# EAGLE design iGeigie-v2 (EAGLE 5.10)
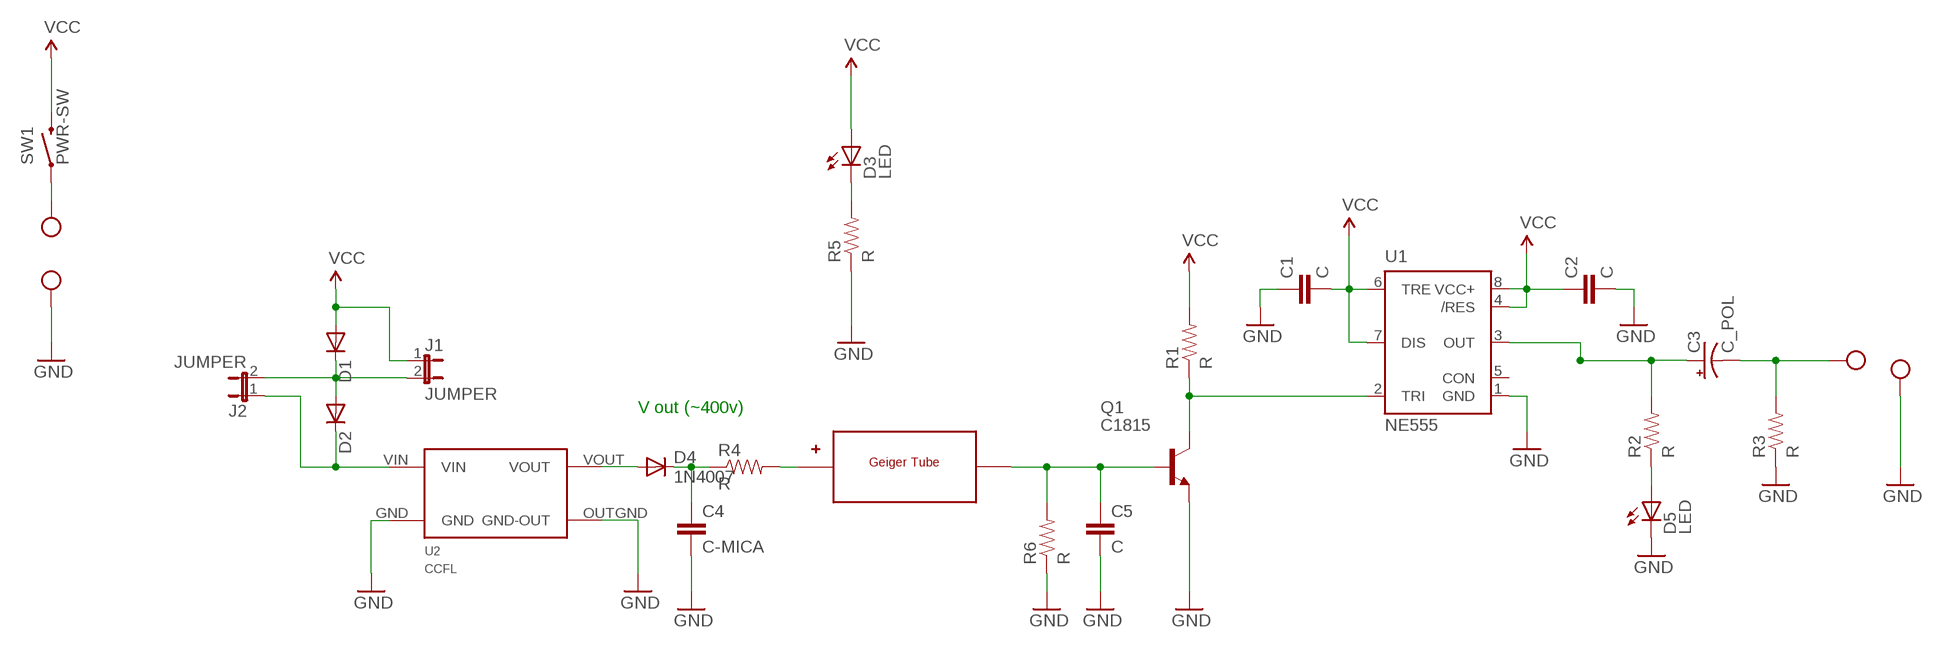
[diagram p0: schematic, sheet 1]

## Parts
C1  C  [C050-025X075]
C2  C  [C050-025X075]
C3  C_POL  [CPOL-RADIAL-100UF-25V]
C4  C-MICA  [C075-063X106]
C5  C  [C050-025X075]
D1  1N4004  [DO41-10]
D2  1N4004  [DO41-10]
D3  LED  [LED3MM]
D4  1N4007  1N4004  [DO41-10]
D5  LED  [LED3MM]
J1  JUMPER  [1X02]
J2  JUMPER  [1X02]
Q1  C1815  [TO92]
R1  R  [AXIAL-0.3]
R2  R  [AXIAL-0.3]
R3  R  [AXIAL-0.3]
R4  R  [AXIAL-0.3]
R5  R  [AXIAL-0.3]
R6  R  [AXIAL-0.3]
SW1  PWR-SW  [PWR_SWITCH]
U1  NE555  [DIL-08]
U2  CCFL  [CCFL]
U$1  PIN  [PIN]
U$2  PIN  [PIN]
U$3  PIN  [PIN]
U$4  PIN  [PIN]
U$5  GEIGER  [GEIGER]

## Nets
GND: C1.1 C2.2 C4.2 C5.2 D5.K(C) Q1.3(E) R3.P$1 R5.P$1 R6.P$1 U1.1(GND) U2.GND U2.OUTGND(GND-OUT) U$2.P$1 U$3.P$1
N$1: C4.1 D4.C R4.P$1
N$2: R4.P$2 U$5.+
N$3: D3.K(C) R5.P$2
N$4: D1.C D2.A J1.2 J2.2
N$5: C5.1 Q1.2(B) R6.P$2 U$5.-
N$6: Q1.1(C) R1.P$1 U1.2(TRI)
N$7: C3.+ R2.P$2 U1.3(OUT)
N$8: D5.A R2.P$1
N$9: C3.- R3.P$2 U$1.P$1
N$10: D2.C J2.1 U2.VIN
N$11: D4.A U2.VOUT
N$12: SW1.2 U$4.P$1
VCC: C1.2 C2.1 D1.A D3.A J1.1 R1.P$2 SW1.3 U1.4(/RES) U1.6(TRE) U1.7(DIS) U1.8(VCC+)
Unconnected: U1.5(CON)

## Notes on the sheet
- V out (~400v)

## Library data of the parts
C1 C2 C5 = iGeigie:C
C3 = iGeigie:C_POL
C4 = iGeigie:C-MICA
D1 D2 D4 = iGeigie:1N4004: DIODE general purpose rectifier, 1 A
D3 D5 = iGeigie:LED
J1 J2 = iGeigie:JUMPER
Q1 = iGeigie:C1815: NPN Transistor
R1-R6 = iGeigie:R
SW1 = iGeigie:PWR-SW
U1 = iGeigie:NE555: General purpose bipolar Timer
U2 = iGeigie:CCFL
U$1-U$4 = iGeigie:PIN
U$5 = iGeigie:GEIGER

## Board
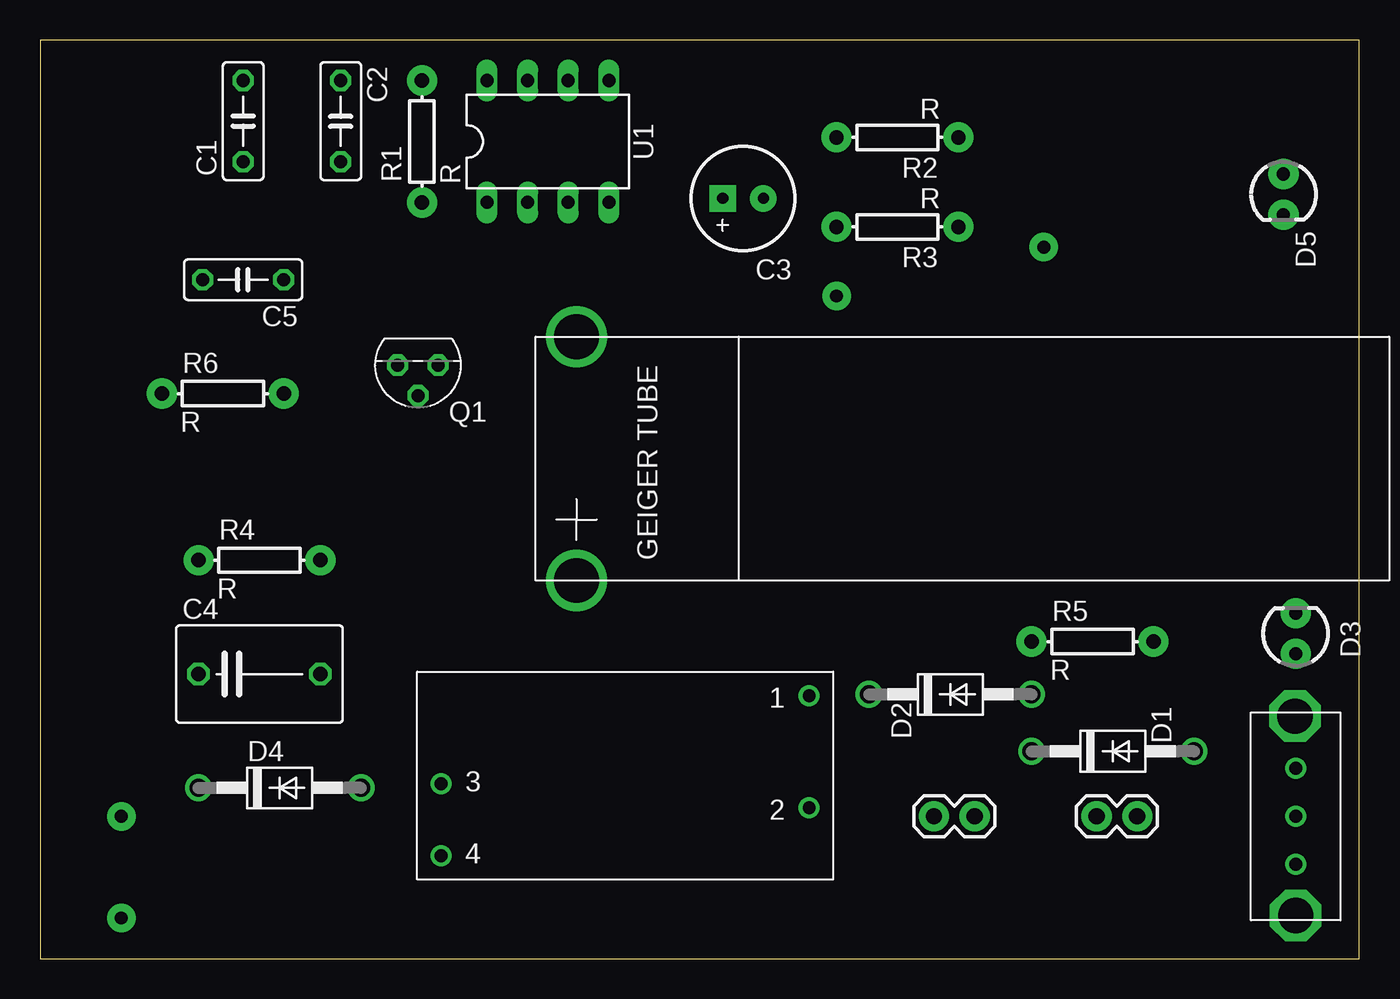
[diagram p1: board, top side]
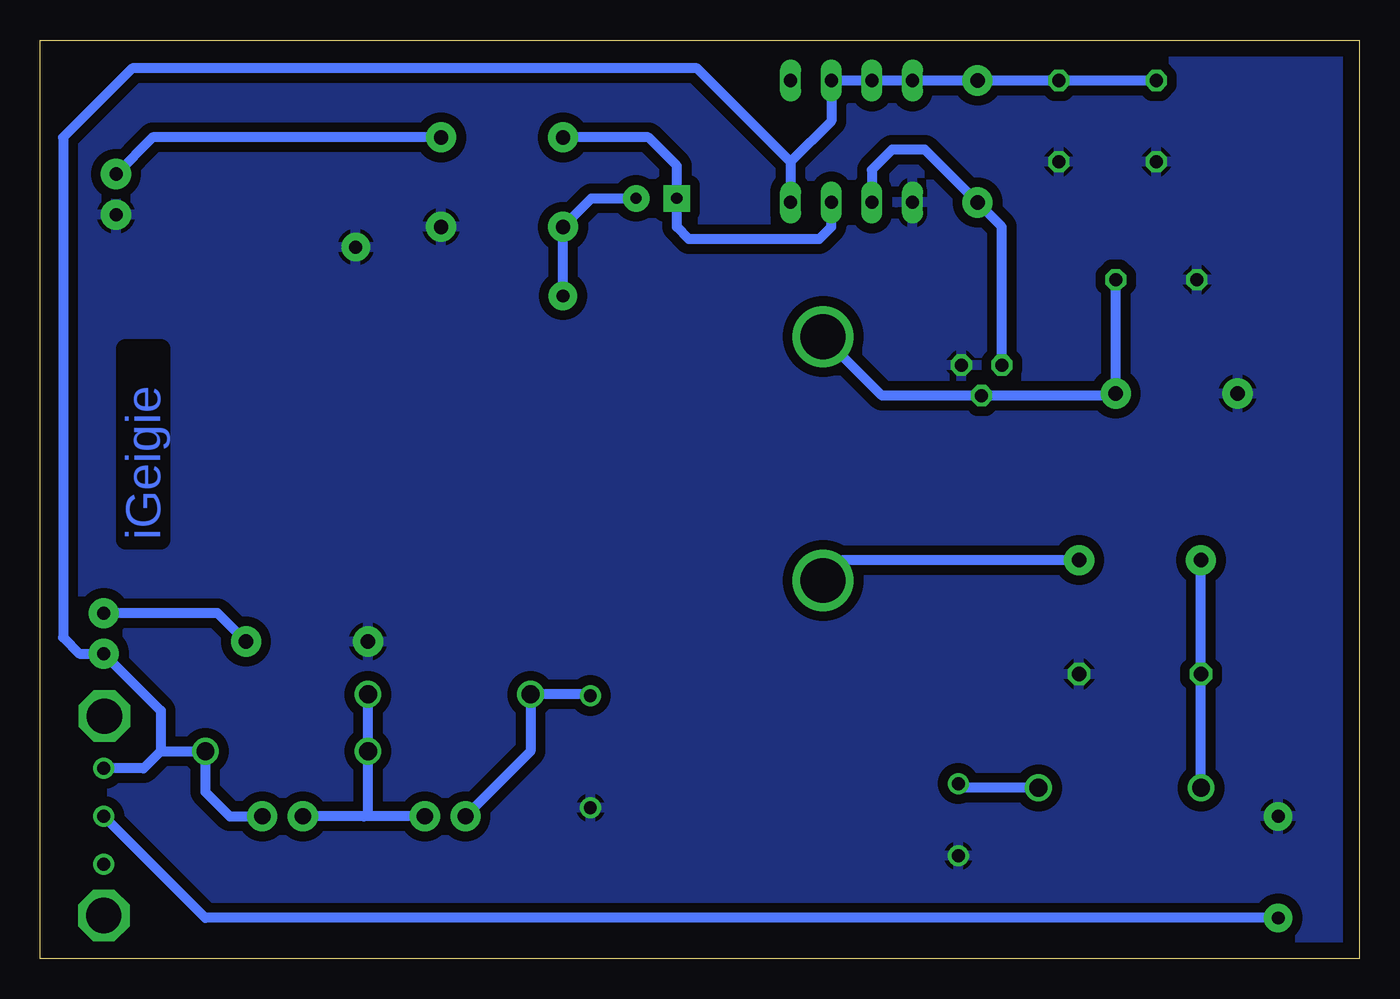
[diagram p2: board, bottom side, seen from below]

Size 82.47 x 57.39 mm. Coordinates in mm from the lower left corner, seen from the top.
Outline: 0,0 82.47,0 82.47,57.39 0,57.39 0,0
Copper layers (1*16): Top 0.035mm / dielectric 1.5mm / Bottom 0.035mm
Design rules "default": minimum track width 10mil, minimum drill 24mil, track to track 8mil, track to pad 8mil, pad to pad 8mil, via to via 8mil, smd to smd 8mil, copper to edge 40mil, drill to drill 8mil, minimum pad ring 10mil, minimum via ring 8mil, stop-mask expansion 4mil, vias tented up to drill 0mil, thermal gap 10mil

### Footprints (pad centres in the part's own frame; a part is rotated, then mirrored left to right if it is on the bottom)
C050-025X075 = drill 0.813 octagon: 1 -2.54,0; 2 2.54,0
CPOL-RADIAL-100UF-25V = drill 0.7 pad 1.651 square: + 1.27,0 | drill 0.7 pad 1.651 round: - -1.27,0
C075-063X106 = drill 0.914 octagon: 1 -3.81,0; 2 3.81,0
DO41-10 = drill 1.118 round: A 5.08,0; C -5.08,0
LED3MM = drill 0.813 pad 1.88 round: A -1.27,0; K 1.27,0
1X02 = drill 1.016 pad 1.88 round: 1 0,0; 2 2.54,0
TO92 = drill 0.813 octagon: 1 1.27,0; 2 0,1.905; 3 -1.27,0
AXIAL-0.3 = drill 0.9 pad 1.88 round: P$1 -3.81,0; P$2 3.81,0
PWR_SWITCH = drill 0.8 round: 1 -3,0; 2 0,0; 3 3,0 | drill 2.2 octagon: NC1 -6.2,0; NC2 6.26,0.04
DIL-08 = drill 0.813 long: 1 -3.81,-3.81; 2 -1.27,-3.81; 3 1.27,-3.81; 4 3.81,-3.81; 5 3.81,3.81; 6 1.27,3.81; 7 -1.27,3.81; 8 -3.81,3.81
CCFL = drill 0.8 round: GND -11.5,2; OUTGND 11.5,5; VIN -11.5,-5; VOUT 11.5,0.5
PIN = drill 0.8 pad 1.778 round: P$1 0,0
GEIGER = drill 2.8 round: + -7.62,0; - 7.62,0

### Placement (x,y rotation side)
C1  12.7,52.32 90 top
C2  18.8,52.32 270 top
C3  43.94,47.5 180 top
C4  13.72,17.78 0 top
C5  12.7,42.42 180 top
D1  67.06,12.95 0 top
D2  56.9,16.51 0 top
D3  78.49,20.32 90 top
D4  14.99,10.67 0 top
D5  77.72,47.75 270 top
J1  68.58,8.89 180 top
J2  55.88,8.89 0 top
Q1  23.62,37.08 180 top
R1  23.88,51.05 90 top
R2  53.59,51.31 180 top
R3  53.59,45.72 180 top
R4  13.72,24.89 0 top
R5  65.79,19.81 0 top
R6  11.43,35.31 0 top
SW1  78.49,8.89 90 top
U1  31.75,51.05 0 top
U2  36.58,11.43 180 top
U$1  49.78,41.4 0 top
U$2  62.74,44.45 0 top
U$3  5.08,8.89 0 top
U$4  5.08,2.54 0 top
U$5  33.53,31.24 90 top

### Tracks (layer width: path | path; a pad name or v marks a point on that pad's centre or on a via)
GND
  pour Bottom (isolate 0.61): -0.51,58.17 101.6,58.17 101.6,-1.52 -0.51,-1.52
N$1
  Bottom 0.61: D4.C C4.1 R4.P$1
N$2
  Bottom 0.61: R4.P$2 32.26,24.89 U$5.+
N$3
  Bottom 0.61: D3.K 71.37,21.59 R5.P$2
N$4
  Bottom 0.61: D2.A D1.C 61.98,9.14 62.23,8.89 | J2.2 62.23,8.89 | 62.23,8.89 J1.2
N$5
  Bottom 0.61: C5.1 R6.P$2 15.37,35.18 Q1.2 29.84,35.18 U$5.-
N$6
  Bottom 0.61: U1.2 30.48,49.28 29.21,50.55 27.18,50.55 R1.P$1 22.35,45.72 Q1.1
N$7
  Bottom 0.61: U1.3 33.02,45.72 33.78,44.96 41.91,44.96 42.67,45.72 C3.+ 42.67,49.53 44.45,51.31 R2.P$2
N$8
  Bottom 0.61: R2.P$1 75.44,51.31 D5.A
N$9
  Bottom 0.61: C3.- 48.01,47.5 R3.P$2 U$1.P$1
N$10
  Bottom 0.61: J2.1 51.82,12.95 D2.C 48.16,16.51 U2.VIN
N$11
  Bottom 0.61: D4.A 24.81,10.67 U2.VOUT
N$12
  Bottom 0.61: U$4.P$1 72.14,2.54 SW1.2
VCC
  Bottom 0.61: 35.56,49.78 33.02,52.32 U1.6 U1.7 U1.8 R1.P$2 C2.1 C1.2 | 35.56,49.78 U1.4 | D3.A 80.01,19.05 81.03,20.07 81.03,51.31 76.71,55.63 41.4,55.63 35.56,49.78 | D3.A 78.23,19.05 | SW1.3 75.99,11.89 74.93,12.95 | 74.93,12.95 74.93,15.49 D3.A | 74.93,12.95 D1.A 72.14,10.41 70.61,8.89 J1.1

### Text on the board
Bottom: iGeigie